# Altium schematic sheet bq25611d_Battery_Charger.SchDoc: bq25611d Battery Charger
size A4; DocumentNumber: 3; SheetNumber: 3; SheetTotal: 50
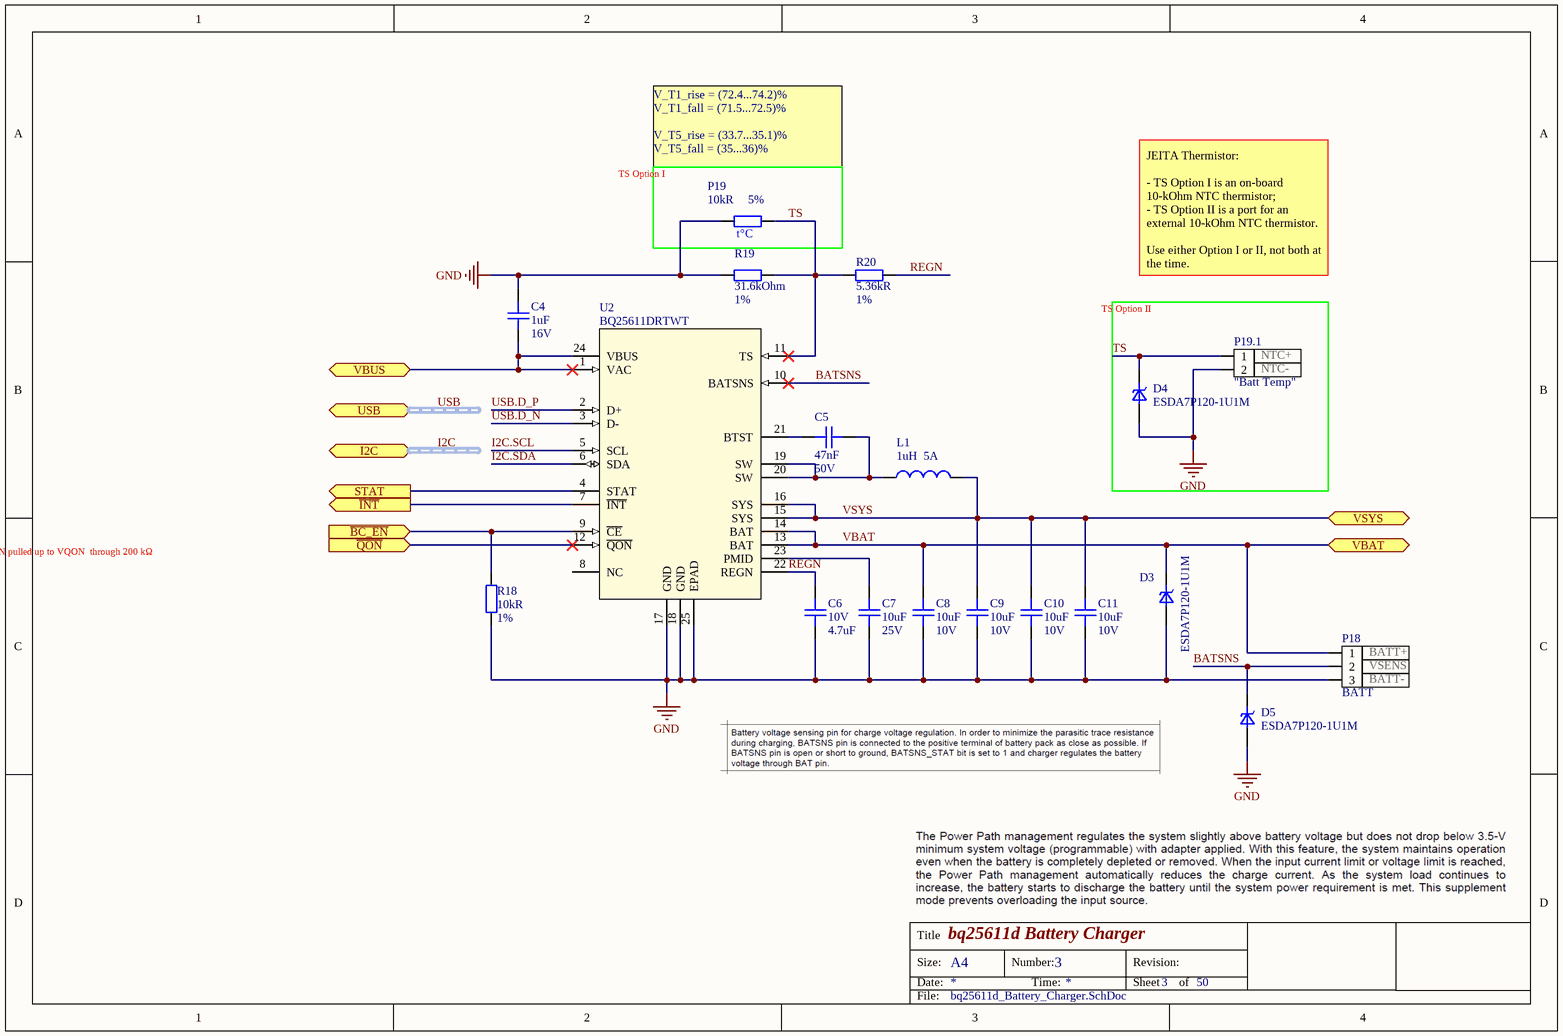
[diagram p0: bq25611d_Battery_Charger.SchDoc]

## Parts
C4  Capacitance: 1uF  Voltage Rating: 16V  [C0603]  (hidden comment: CAP CER 1UF 16V X5R 0603)
C5  Capacitance: 47nF  Voltage Rating: 50V  [C0402]  (hidden comment: CAP CER 0.047UF 50V X7R 0402)
C6  Voltage Rating: 10V  Capacitance: 4.7uF  [C0603]  (hidden comment: CAP CER 4.7UF 10V X5R 0603)
C7  Capacitance: 10uF  Voltage Rating: 25V  [C1206]  (hidden comment: CAP CER 10UF 25V X7R 1206)
C8  Capacitance: 10uF  Voltage Rating: 10V  [C0805]  (hidden comment: CAP CER 10uF X7R 10% 0805)
C9  Capacitance: 10uF  Voltage Rating: 10V  [C0805]  (hidden comment: CAP CER 10uF X7R 10% 0805)
C10  Capacitance: 10uF  Voltage Rating: 10V  [C0805]  (hidden comment: CAP CER 10uF X7R 10% 0805)
C11  Capacitance: 10uF  Voltage Rating: 10V  [C0805]  (hidden comment: CAP CER 10uF X7R 10% 0805)
D3  ESDA7P120-1U1M  [ST_QFN_1610]
D4  ESDA7P120-1U1M  [ST_QFN_1610]
D5  ESDA7P120-1U1M  [ST_QFN_1610]
L1  Inductance: 1uH  Current Rating: 5A  [IND_IHLP-1212B00]  (hidden comment: FIXED IND 1UH 5A 24 MOHM SMD)
P18  BATT  pin_1: BATT+  pin_2: VSENS  pin_3: BATT-  [CONN_S3B-ZR_JST]
P19  Resistance: 10kR  Tolerance: 5%  [R0603]  (hidden comment: THERMISTOR NTC 10KOHM 3380K 0603)
P19.1  "Batt Temp"  pin_1: NTC+  pin_2: NTC-  [CONN_S2B-ZR_JST]
R18  Resistance: 10kR  Tolerance: 1%  [R0402]  (hidden comment: RES SMD 10K OHM 1% 1/16W 0402)
R19  Resistance: 31.6kOhm  Tolerance: 1%  [R0402]  (hidden comment: RES SMD 31.6K OHM 1% 1/16W 0402)
R20  Resistance: 5.36kR  Tolerance: 1%  [R0402]  (hidden comment: RES SMD 5.36K OHM 1% 1/16W 0402)
U2  BQ25611DRTWT  [RTW0024]

## Blocks framed on the sheet
TS Option I: P19
TS Option II: D4 P19.1

## Ports
I2C (harness I2C), STAT (out), USB (harness USB), VBAT, VBUS, VSYS, ~{BC_EN} (in), ~{INT} (out), ~{QON} (in)

## Nets
GND: C4.1 C6.1 C7.1 C8.1 C9.1 C10.1 C11.1 D3.2(A) D4.2(A) D5.2(A) P18.3 P19.2 P19.1.2 R18.2 R19.1 U2.17(GND) U2.18(GND) U2.25(EPAD)
~{BC_EN}: R18.1 U2.9(~{CE}) ; port ~{BC_EN}
~{INT}: U2.7(~{INT}) ; port ~{INT}
~{QON}: U2.12(~{QON}) ; port ~{QON}
BATSNS: D5.1(K) P18.2 U2.10(BATSNS)
I2C.SCL: U2.5(SCL)
I2C.SDA: U2.6(SDA)
REGN: C6.2 R20.1 U2.22(REGN)
STAT: U2.4(STAT) ; port STAT
TS: D4.1(K) P19.1 P19.1.1 R19.2 R20.2 U2.11(TS)
USB.D_N: U2.3(D-)
USB.D_P: U2.2(D+)
VBAT: C8.2 D3.1(K) P18.1 U2.13(BAT) U2.14(BAT) ; port VBAT
VBUS: C4.2 U2.1(VAC) U2.24(VBUS) ; port VBUS
VSYS: C9.2 C10.2 C11.2 L1.2 U2.15(SYS) U2.16(SYS) ; port VSYS
NetC5_1: C5.1 U2.21(BTST)
NetC5_2: C5.2 L1.1 U2.19(SW) U2.20(SW)
NetC7_2: C7.2 U2.23(PMID)

Not connected (* = marked no-connect by the designer): U2 8(NC)

## Buses and harness runs
harness I2C = port I2C
harness USB = port USB

## Notes on the sheet
- V_T1_rise = (72.4...74.2)%
  V_T1_fall = (71.5...72.5)%
  V_T5_rise = (33.7...35.1)%
  V_T5_fall = (35...36)%
- JEITA Thermistor:
  - TS Option I is an on-board 10-kOhm NTC thermistor;
  - TS Option II is a port for an external 10-kOhm NTC thermistor.
  Use either Option I or II, not both at the time.
- QON pulled up to VQON  through 200 kΩ
- Title
- Size:
- Date:
- A4
- Number:
- Time:
- Revision:
- Sheet
- of
- File:
- (in symbol THERMISTOR NTC 10KOHM 3380K 0603) t°C

## Library data of the parts
C4 = CAP CER 1UF 16V X5R 0603: 1µF ±10% 16V Ceramic Capacitor X5R 0603 (1608 Metric); Manuf_Part_1: CC0603KRX5R7BB105; Manuf_1: YAGEO; Dissipation Factor: 7%; Revision: July-2002: Re-released for DXP Platform.; Order: CC0603KRX5R7BB105; Supplier 1: Digi-Key; Manufacturer: Yageo; Manufacturer Part Number: CC0603KRX5R7BB105; Stock 1: 2299176; Pricing 1: 1=0.11, 10=0.081, 100=0.0382, 500=0.0268, 1000=0.0222 (USD); Mount: Surface Mount; Number of Pins: 2; Case Code (Imperial): 0603; Case Code (Metric): 1608; Min Operating Temperature: -55°C; Max Operating Temperature: 85°C; Tolerance: 10%; Dielectric: X5R; Voltage Rating (DC): 16V; Packaging: Tape and Reel; Package Quantity: 4000; Termination: SMD/SMT; Composition: Ceramic; Length: 1.6mm; Height: 0.8mm; Width: 0.8mm; Thickness: 0.035inch; Depth: 0.8mm; Radiation Hardening: No; REACH SVHC: Unknown; Lead Free: Lead Free; Halogen Free: Halogen Free; ComponentLink1URL: https://www.verical.com/server-webapp/html/getDatasheet?partID=317657&src-supplier=Verical; ComponentLink1Description: https://www.verical.com/server-webapp/html/getDatasheet?partID=317657&src-supplier=Verical; ComponentLink2URL: http://www.yageo.com/documents/recent/UPY-GPHC_X5R_4V-to-50V_25.pdf?src-supplier=Digi-Key; ComponentLink2Description: http://www.yageo.com/documents/recent/UPY-GPHC_X5R_4V-to-50V_25.pdf?src-supplier=Digi-Key; ComponentLink3URL: http://www.farnell.com/datasheets/1525783.pdf?src-supplier=Element14; ComponentLink3Description: http://www.farnell.com/datasheets/1525783.pdf?src-supplier=Element14; ComponentLink4URL: http://www.farnell.com/datasheets/1359354.pdf?src-supplier=Element14; ComponentLink4Description: http://www.farnell.com/datasheets/1359354.pdf?src-supplier=Element14; ComponentLink5URL: http://www.yageo.com/documents/recent/UPY-GPHC_X5R_4V-to-50V_12.pdf?src-supplier=Avnet; ComponentLink5Description: http://www.yageo.com/documents/recent/UPY-GPHC_X5R_4V-to-50V_12.pdf?src-supplier=Avnet; Supplier Part Number 1: 311-1444-1-ND; Value: 1uF; Case/Package: 0603
C5 = CAP CER 0.047UF 50V X7R 0402: 0.047µF ±10% 50V Ceramic Capacitor X7R 0402 (1005 Metric); Manufacturer: TDK; Manufacturer Part Number: CGA2B3X7R1H473K050BB; Supplier 1: Digi-Key; Stock 1: 1255429; Pricing 1: 1=0.11, 10=0.083, 50=0.045, 100=0.0368, 500=0.0263, 1000=0.0207, 2500=0.0188, 5000=0.0173 (USD); Mount: Surface Mount; Case/Package: 0402; Weight: 2.3E-05oz; Case Code (Metric): 1005; Case Code (Imperial): 0402; Min Operating Temperature: -55°C; Max Operating Temperature: 125°C; Tolerance: 10%; Dielectric: X7R; Voltage Rating (DC): 50V; Packaging: Tape and Reel; Termination: SMD/SMT; Package Quantity: 1; Composition: Ceramic; Length: 1mm; Height: 0.5mm; Width: 0.02inch; Thickness: 0.022inch; Depth: 0.5mm; Ratings: AEC-Q200; Radiation Hardening: No; Lead Free: Lead Free; REACH SVHC: No SVHC; ComponentLink1URL: http://www.farnell.com/datasheets/1807242.pdf?src-supplier=Element14; ComponentLink1Description: http://www.farnell.com/datasheets/1807242.pdf?src-supplier=Element14; ComponentLink2URL: http://www.farnell.com/datasheets/1735392.pdf?src-supplier=Element14; ComponentLink2Description: http://www.farnell.com/datasheets/1735392.pdf?src-supplier=Element14; ComponentLink3URL: http://www.mouser.com/ds/2/400/lcc_automotive_general_en-843974.pdf?src-supplier=Mouser; ComponentLink3Description: http://www.mouser.com/ds/2/400/lcc_automotive_general_en-843974.pdf?src-supplier=Mouser; Supplier Part Number 1: 445-6897-1-ND
C6 = CAP CER 4.7UF 10V X5R 0603: 4.7µF ±10% 10V Ceramic Capacitor X5R 0603 (1608 Metric); Manufacturer: Yageo; Manufacturer Part Number: CC0603KRX5R6BB475; Supplier 1: Digi-Key; Stock 1: 325858; Pricing 1: 1=0.26, 10=0.18, 100=0.102, 500=0.072, 1000=0.063 (USD); Mount: Surface Mount; Case Code (Imperial): 0603; Case Code (Metric): 1608; Min Operating Temperature: -55°C; Max Operating Temperature: 85°C; Voltage Rating (DC): 10V; Tolerance: 10%; Packaging: Tape and Reel; Package Quantity: 1; Dielectric: X5R; Termination: SMD/SMT; Composition: Ceramic; Length: 1.6mm; Height: 0.8mm; Width: 0.8mm; Thickness: 0.035inch; Depth: 0.8mm; Radiation Hardening: No; REACH SVHC: Unknown; Lead Free: Lead Free; Halogen Free: Halogen Free; ComponentLink1URL: http://www.farnell.com/datasheets/2167237.pdf?src-supplier=Element14; ComponentLink1Description: http://www.farnell.com/datasheets/2167237.pdf?src-supplier=Element14; ComponentLink2URL: http://www.yageo.com/documents/recent/UPY-GPHC_X5R_4V-to-50V_25.pdf?src-supplier=Digi-Key; ComponentLink2Description: http://www.yageo.com/documents/recent/UPY-GPHC_X5R_4V-to-50V_25.pdf?src-supplier=Digi-Key; ComponentLink3URL: http://www.yageo.com/documents/recent/UPY-GPHC_X5R_4V-to-50V_12.pdf?src-supplier=Avnet; ComponentLink3Description: http://www.yageo.com/documents/recent/UPY-GPHC_X5R_4V-to-50V_12.pdf?src-supplier=Avnet; ComponentLink4URL: http://www.yageo.com/documents/recent/UPY-GPHC_X5R_4V-to-50V_12.pdf?src-supplier=Avnet+Europe; ComponentLink4Description: http://www.yageo.com/documents/recent/UPY-GPHC_X5R_4V-to-50V_12.pdf?src-supplier=Avnet+Europe; Supplier Part Number 1: 311-1455-1-ND; Case/Package: 0603
C7 = CAP CER 10UF 25V X7R 1206: 10µF ±10% 25V Ceramic Capacitor X7R 1206 (3216 Metric); Manufacturer: Yageo; Manufacturer Part Number: CC1206KKX7R8BB106; Supplier 1: Digi-Key; Stock 1: 3990; Pricing 1: 1=0.49, 10=0.348, 50=0.2632, 100=0.2293, 500=0.1698, 1000=0.1444 (USD); Mount: Surface Mount; Case/Package: 1206; Weight: 0.000571oz; Case Code (Imperial): 1206; Case Code (Metric): 3216; Min Operating Temperature: -55°C; Max Operating Temperature: 125°C; Tolerance: 10%; Packaging: Tape and Reel; Voltage Rating (DC): 25V; Dielectric: X7R; Termination: SMD/SMT; Composition: Ceramic; Length: 3.2mm; Width: 1.6mm; Thickness: 0.071inch; Depth: 1.6mm; Radiation Hardening: No; Lead Free: Lead Free; Halogen Free: Halogen Free; ComponentLink1URL: http://www.yageo.com/documents/recent/UPY-GPHC_X7R_6.3V-to-50V_8.pdf?src-supplier=Avnet; ComponentLink1Description: http://www.yageo.com/documents/recent/UPY-GPHC_X7R_6.3V-to-50V_8.pdf?src-supplier=Avnet; ComponentLink2URL: http://www.mouser.com/ds/2/447/Yageo_UPY-GP_NP0_16V-to-50V_9-358835.pdf?src-supplier=Mouser; ComponentLink2Description: http://www.mouser.com/ds/2/447/Yageo_UPY-GP_NP0_16V-to-50V_9-358835.pdf?src-supplier=Mouser; ComponentLink3URL: http://components.arrow.com/part/dataview/0323_04166677?src-supplier=Arrow+Europe; ComponentLink3Description: http://components.arrow.com/part/dataview/0323_04166677?src-supplier=Arrow+Europe; ComponentLink4URL: http://www.yageo.com/documents/recent/UPY-GPHC_X7R_6.3V-to-50V_18.pdf?src-supplier=Digi-Key; ComponentLink4Description: http://www.yageo.com/documents/recent/UPY-GPHC_X7R_6.3V-to-50V_18.pdf?src-supplier=Digi-Key; ComponentLink5URL: http://www.yageo.com/documents/recent/UPY-GPHC_X7R_6.3V-to-50V_9.pdf?src-supplier=Future+Electronics; ComponentLink5Description: http://www.yageo.com/documents/recent/UPY-GPHC_X7R_6.3V-to-50V_9.pdf?src-supplier=Future+Electronics; Supplier Part Number 1: 311-1959-1-ND
C8-C11 = CAP CER 10uF X7R 10% 0805: Capacitor,10uF,10V,X7R,10%,0805,Murata; Manufacturer Part Number: GRM21BR71A106KA73L; Supplier 1: Digi-Key; Manufacturer: Murata; Stock 1: 2099435; Pricing 1: 1=0.26, 10=0.176, 100=0.089, 500=0.0609, 1000=0.0538 (USD); Mount: Surface Mount; Case/Package: 0805; Case Code (Imperial): 0805; Case Code (Metric): 2012; Min Operating Temperature: -55°C; Max Operating Temperature: 125°C; Tolerance: 10%; Dielectric: X7R; Voltage Rating (DC): 10V; Packaging: Tape and Reel; Package Quantity: 3000; Termination: SMD/SMT; Length: 2mm; Height: 1.25mm; Width: 1.25mm; Thickness: 0.055inch; Depth: 1.25mm; REACH SVHC: No SVHC; ComponentLink1URL: http://components.arrow.com/part/dataview/0323_07281730?src-supplier=Arrow+Europe; ComponentLink1Description: http://components.arrow.com/part/dataview/0323_07281730?src-supplier=Arrow+Europe; ComponentLink2URL: http://www.mouser.com/ds/2/281/c02e-2905.pdf?src-supplier=Mouser; ComponentLink2Description: http://www.mouser.com/ds/2/281/c02e-2905.pdf?src-supplier=Mouser; ComponentLink3URL: http://www.farnell.com/datasheets/2079188.pdf?src-supplier=Newark; ComponentLink3Description: http://www.farnell.com/datasheets/2079188.pdf?src-supplier=Newark; ComponentLink4URL: http://www.farnell.com/datasheets/2079188.pdf?src-supplier=Farnell; ComponentLink4Description: http://www.farnell.com/datasheets/2079188.pdf?src-supplier=Farnell; ComponentLink5URL: http://www.farnell.com/datasheets/2079188.pdf?src-supplier=Element14; ComponentLink5Description: http://www.farnell.com/datasheets/2079188.pdf?src-supplier=Element14; Supplier Part Number 1: 490-10516-1-ND; Weight: 0.000335oz; ComponentLink6URL: http://search.murata.co.jp/Ceramy/image/img/A01X/G101/ENG/GRM21BR71A106KA73-01.pdf?src-supplier=Digi-Key; ComponentLink6Description: http://search.murata.co.jp/Ceramy/image/img/A01X/G101/ENG/GRM21BR71A106KA73-01.pdf?src-supplier=Digi-Key
D3-D5 = TVS DIODE ESDA7P120-1U1M 5.5V 11.5V 1610: 11.5V Clamp 120A (8/20µs) Ipp Tvs Diode Surface Mount 1610; Manufacturer: STMicroelectronics; Reverse Standoff Voltage: 5.5V; Number of Unidirectional Channels: 1; Min Breakdown Voltage: 6.4V; Peak Pulse Power: 1.4kW; Power Line Protection: No; Supplier 1: Digi-Key; Manufacturer Part Number: ESDA7P120-1U1M; Stock 1: 15775; Pricing 1: 1=0.35, 10=0.287, 25=0.2624, 100=0.1647, 250=0.1629, 500=0.1525, 1000=0.1037, 2500=0.0994 (USD); Packaging: Cut Tape; ComponentLink1URL: http://www.st.com/content/ccc/resource/technical/document/datasheet/group3/5e/7c/5d/76/3f/de/45/35/DM00359316/files/DM00359316.pdf/jcr:content/translations/en.DM00359316.pdf?src-supplier=Digi-Key; ComponentLink1Description: http://www.st.com/content/ccc/resource/technical/document/datasheet/group3/5e/7c/5d/76/3f/de/45/35/DM00359316/files/DM00359316.pdf/jcr:content/translations/en.DM00359316.pdf?src-supplier=Digi-Key; Supplier Part Number 1: 497-17159-1-ND; Mount: Surface Mount; Case/Package: 0603; Case Code (Imperial): 0603; Case Code (Metric): 1610; Min Operating Temperature: -55°C; Max Operating Temperature: 150°C; Composition: Zener; Clamping Voltage: 11.5V; Peak Pulse Current: 120A; ComponentLink2URL: http://www.farnell.com/datasheets/2815837.pdf?src-supplier=Newark; ComponentLink2Description: http://www.farnell.com/datasheets/2815837.pdf?src-supplier=Newark; ComponentLink3URL: http://www.farnell.com/datasheets/2815837.pdf?src-supplier=Farnell; ComponentLink3Description: http://www.farnell.com/datasheets/2815837.pdf?src-supplier=Farnell; ComponentLink4URL: http://www.farnell.com/datasheets/2815837.pdf?src-supplier=Element14; ComponentLink4Description: http://www.farnell.com/datasheets/2815837.pdf?src-supplier=Element14
L1 = FIXED IND 1UH 5A 24 MOHM SMD: 1µH Shielded Molded Inductor 5A 24mOhm Max Nonstandard; Manufacturer: Vishay Dale; Manufacturer Part Number: IHLP1212BZER1R0M11; Core Material: Metal,Composite; Tolerance: 20%; DC Resistance (DCR): 24mR; Self Resonant Frequency: 75MHz; Saturation Current: 4.5A; Test Frequency: 100kHz; Supplier 1: Digi-Key; Stock 1: 70286; Pricing 1: 1=1.39, 10=1.287, 25=1.188, 50=0.99, 100=0.9306, 250=0.8316, 500=0.7128, 1000=0.6336 (USD); Mount: Surface Mount; Case/Package: 1212; Number of Pins: 2; Case Code (Metric): 3630; Case Code (Imperial): 1212; Contact Plating: Tin; Min Operating Temperature: -55°C; Max Operating Temperature: 125°C; Shielding: Shielded; Packaging: Tape and Reel; Package Quantity: 3000; Inductance Tolerance: 20%; Max DC Current: 5A; Termination: SMD/SMT; RMS Current (Irms): 5A; Military Standard: Not; Length: 3.6mm; Height: 2mm; Depth: 3.2mm; Width: 0.118inch; Height - Seated (Max): 0.079inch; Radiation Hardening: No; REACH SVHC: Unknown; Lead Free: Lead Free; ComponentLink1URL: http://www.mouser.com/ds/2/427/lp12bz11-244380.pdf?src-supplier=Mouser; ComponentLink1Description: http://www.mouser.com/ds/2/427/lp12bz11-244380.pdf?src-supplier=Mouser; ComponentLink2URL: http://www.vishay.com/docs/34289/lp12bz11.pdf?src-supplier=Digi-Key; ComponentLink2Description: http://www.vishay.com/docs/34289/lp12bz11.pdf?src-supplier=Digi-Key; ComponentLink3URL: http://www.vishay.com/docs/34289/lp12bz11.pdf?src-supplier=Avnet; ComponentLink3Description: http://www.vishay.com/docs/34289/lp12bz11.pdf?src-supplier=Avnet; ComponentLink4URL: http://www.farnell.com/datasheets/652599.pdf?src-supplier=Element14; ComponentLink4Description: http://www.farnell.com/datasheets/652599.pdf?src-supplier=Element14; ComponentLink5URL: http://www.vishay.com/docs/34289/lp12bz11.pdf?src-supplier=Avnet+Europe; ComponentLink5Description: http://www.vishay.com/docs/34289/lp12bz11.pdf?src-supplier=Avnet+Europe; ComponentLink6URL: https://www.verical.com/server-webapp/html/getDatasheet?partID=180380&src-supplier=Verical; ComponentLink6Description: https://www.verical.com/server-webapp/html/getDatasheet?partID=180380&src-supplier=Verical; Supplier Part Number 1: 541-1319-1-ND
P18 = CONN HEADER TH R/A 3POS 1.5MM: Connector Header Through Hole, Right Angle 3 position 0.059" (1.50mm); Manufacturer: JST; Manufacturer Part Number: S3B-ZR(LF)(SN); Number of Positions: 3; Connector Type: Male Pin; Voltage Rating: 50V; Contact Resistance: 30mR; Max Current Rating: 1A; Gender: Male; Pitch: 1.5mm; Body Plating: Tin; Insulation Resistance: 500MR; Panel Thickness: 3.5mm; Supplier 1: Digi-Key; Stock 1: 0; Mount: Through Hole; Number of Pins: 3; Color: Natural,White; Contact Plating: Tin,Copper; Contact Material: Brass,Copper,Tin; Housing Color: Beige; Housing Material: Polyamide; Min Operating Temperature: -25°C; Max Operating Temperature: 85°C; Packaging: Bulk; Number of Rows: 1; Termination: Press-Fit; Current Rating: 1A; Fastening Type: Detent; Max Voltage Rating (AC): 50V; Number of Contacts: 3; Orientation: Right Angle; Length: 6mm; Height: 7.2mm; Width: 3.5mm; Depth: 6mm; Contact Mating Length: 0.094inch; Lead Free: Lead Free; ComponentLink1URL: http://www.jst-mfg.com/product/pdf/eng/eZH.pdf?src-supplier=Digi-Key; ComponentLink1Description: http://www.jst-mfg.com/product/pdf/eng/eZH.pdf?src-supplier=Digi-Key; ComponentLink2URL: https://www.verical.com/server-webapp/html/getDatasheet?partID=722697&src-supplier=Verical; ComponentLink2Description: https://www.verical.com/server-webapp/html/getDatasheet?partID=722697&src-supplier=Verical; ComponentLink3URL: http://www.produktinfo.conrad.com/datenblaetter/725000-749999/741155-da-01-en-STIFTLEISTE_GEWINKELT_3_POL_RM1_5.pdf?src-supplier=Conrad; ComponentLink3Description: http://www.produktinfo.conrad.com/datenblaetter/725000-749999/741155-da-01-en-STIFTLEISTE_GEWINKELT_3_POL_RM1_5.pdf?src-supplier=Conrad; Supplier Part Number 1: 455-1670-ND; Pricing 1: 1=0.2, 10=0.184, 100=0.1274, 500=0.1078, 1000=0.0882, 5000=0.0784, 10000=0.071 (USD); Material: Nylon; Voltage Rating (AC): 50V; Voltage Rating (DC): 50V; Lead Pitch: 1.5mm; REACH SVHC: No SVHC; Flammability Rating: UL94 V-0
P19 = THERMISTOR NTC 10KOHM 3380K 0603: NTC Thermistor 10k 0603 (1608 Metric); Manufacturer: Panasonic; Manufacturer Part Number: ERT-J1VG103JA; Max Power Dissipation: 100mW; Accuracy: 1%; Supplier 1: Digi-Key; Stock 1: 28072; Pricing 1: 1=0.15, 5=0.146, 10=0.13, 25=0.12, 50=0.096, 100=0.0824, 500=0.0721, 1000=0.0618 (USD); Mount: Surface Mount; Case/Package: 0603; Number of Pins: 2; Case Code (Metric): 1608; Case Code (Imperial): 0603; Min Operating Temperature: -40°C; Max Operating Temperature: 125°C; Packaging: Tape and Reel; Package Quantity: 4000; Termination: SMD/SMT; Length: 1.6mm; Depth: 0.8mm; Width: 800um; Radiation Hardening: No; Lead Free: Lead Free; REACH SVHC: No SVHC; ComponentLink1URL: http://www.farnell.com/datasheets/2085569.pdf?src-supplier=Farnell; ComponentLink1Description: http://www.farnell.com/datasheets/2085569.pdf?src-supplier=Farnell; ComponentLink2URL: http://www.farnell.com/datasheets/1314428.pdf?src-supplier=Element14; ComponentLink2Description: http://www.farnell.com/datasheets/1314428.pdf?src-supplier=Element14; ComponentLink3URL: https://industrial.panasonic.com/cdbs/www-data/pdf/AUA0000/AUA0000COL16.pdf?src-supplier=Digi-Key; ComponentLink3Description: https://industrial.panasonic.com/cdbs/www-data/pdf/AUA0000/AUA0000COL16.pdf?src-supplier=Digi-Key; ComponentLink4URL: http://industrial.panasonic.com/www-data/pdf/AUA0000/AUA0000CE1.pdf?src-supplier=Future+Electronics; ComponentLink4Description: http://industrial.panasonic.com/www-data/pdf/AUA0000/AUA0000CE1.pdf?src-supplier=Future+Electronics; ComponentLink5URL: https://industrial.panasonic.com/www-data/pdf/AUA0000/AUA0000CE1.pdf?src-supplier=Avnet; ComponentLink5Description: https://industrial.panasonic.com/www-data/pdf/AUA0000/AUA0000CE1.pdf?src-supplier=Avnet; Supplier Part Number 1: P12014CT-ND
P19.1 = CONN HEADER TH R/A 2POS 1.5MM: Connector Header Through Hole, Right Angle 2 position 0.059" (1.50mm); Manufacturer: JST; Manufacturer Part Number: S2B-ZR(LF)(SN); Body Plating: Tin; Number of Positions: 2; Gender: Male; Connector Type: Male Pin; Current Rating: 1A; Contact Resistance: 30mR; Voltage Rating: 50V; Insulation Resistance: 500MR; Pitch: 1.5mm; Panel Thickness: 3.5mm; Supplier 1: Digi-Key; Stock 1: 14685; Pricing 1: 1=0.19, 10=0.177, 100=0.109, 500=0.0902, 1000=0.079, 5000=0.0677, 10000=0.0658 (USD); Mount: Through Hole; Number of Pins: 2; Contact Plating: Tin,Copper; Contact Material: Brass,Tin,Copper; Color: Natural,White; Housing Color: Beige; Housing Material: Polyamide; Material: Nylon; Min Operating Temperature: -25°C; Max Operating Temperature: 85°C; Termination: Press-Fit; Number of Rows: 1; Packaging: Bulk; Fastening Type: Detent; Number of Contacts: 2; Orientation: Right Angle; Voltage Rating (AC): 50V; Voltage Rating (DC): 50V; Max Current Rating: 1A; Max Voltage Rating (AC): 50V; Length: 4.5mm; Height: 7.2mm; Width: 3.5mm; Contact Mating Length: 0.094inch; Depth: 6mm; Lead Pitch: 1.5mm; Lead Free: Lead Free; Flammability Rating: UL94 V-0; REACH SVHC: No SVHC; ComponentLink1URL: http://www.farnell.com/datasheets/80556.pdf?src-supplier=Element14; ComponentLink1Description: http://www.farnell.com/datasheets/80556.pdf?src-supplier=Element14; ComponentLink2URL: http://www1.futureelectronics.com/doc/JST/S2B-ZR(LF)(SN).pdf?src-supplier=Future+Electronics; ComponentLink2Description: http://www1.futureelectronics.com/doc/JST/S2B-ZR(LF)(SN).pdf?src-supplier=Future+Electronics; ComponentLink3URL: http://www.jst-mfg.com/product/pdf/eng/eZH.pdf?src-supplier=Digi-Key; ComponentLink3Description: http://www.jst-mfg.com/product/pdf/eng/eZH.pdf?src-supplier=Digi-Key; ComponentLink4URL: https://www.verical.com/server-webapp/html/getDatasheet?partID=687340&src-supplier=Verical; ComponentLink4Description: https://www.verical.com/server-webapp/html/getDatasheet?partID=687340&src-supplier=Verical; Supplier Part Number 1: 455-1669-ND
R18 = RES SMD 10K OHM 1% 1/16W 0402: 10 kOhms ±1% 0.063W, 1/16W Chip Resistor 0402 (1005 Metric) Moisture Resistant Thick Film; Manufacturer Part Number: RC0402FR-0710KP; Manufacturer: Yageo; Temperature Coefficient: 150ppm/°C; Max Power Dissipation: 63mW; Supplier 1: Digi-Key; Stock 1: 839368; Pricing 1: 1=0.1, 10=0.035, 100=0.014, 1000=0.0063, 2500=0.0055, 5000=0.0045 (USD); Case Code (Imperial): 0402; Case Code (Metric): 1005; Min Operating Temperature: -55°C; Max Operating Temperature: 155°C; Composition: Thick Film; Packaging: Tape and Reel; Number of Terminations: 2; Length: 0.039inch; Height: 0.016inch; Width: 0.02inch; ComponentLink1URL: http://www.yageo.com/NewPortal/yageodocoutput?fileName=/pdf/R-Chip/PYu-RC_51_RoHS_P_0.pdf&src-supplier=Digi-Key; ComponentLink1Description: http://www.yageo.com/NewPortal/yageodocoutput?fileName=/pdf/R-Chip/PYu-RC_51_RoHS_P_0.pdf&src-supplier=Digi-Key; Supplier Part Number 1: YAG1249CT-ND; Case/Package: 0402; Features: Moisture Resistant; Mount: Surface Mount
R19 = RES SMD 31.6K OHM 1% 1/16W 0402: 31.6 kOhms ±1% 0.063W, 1/16W Chip Resistor 0402 (1005 Metric) Moisture Resistant Thick Film; Manufacturer Part Number: RC0402FR-0731K6L; Manufacturer: Yageo; Temperature Coefficient: 100ppm/°C; Voltage Rating (DC): 50V; Power Rating: 62.5mW; Max Power Dissipation: 63mW; Supplier 1: Digi-Key; Stock 1: 2889310; Pricing 1: 1=0.1, 10=0.016, 100=0.0064, 1000=0.0029, 2500=0.0025, 5000=0.0021 (USD); Case Code (Imperial): 0402; Case Code (Metric): 1005; Min Operating Temperature: -55°C; Max Operating Temperature: 155°C; Composition: Thick Film; Packaging: Tape and Reel; Voltage Rating: 50V; Termination: SMD/SMT; Military Standard: Not; Number of Terminations: 2; Length: 1mm; Height: 0.016inch; Width: 0.02inch; Depth: 0.5mm; Lead Free: Lead Free; ComponentLink1URL: http://www.yageo.com/documents/recent/PYu-RC0402_51_RoHS_L_6_r.pdf?src-supplier=Future+Electronics; ComponentLink1Description: http://www.yageo.com/documents/recent/PYu-RC0402_51_RoHS_L_6_r.pdf?src-supplier=Future+Electronics; ComponentLink2URL: http://www.yageo.com/documents/recent/PYu-RC0402_51_RoHS_L_6_r.pdf?src-supplier=Mouser; ComponentLink2Description: http://www.yageo.com/documents/recent/PYu-RC0402_51_RoHS_L_6_r.pdf?src-supplier=Mouser; Supplier Part Number 1: YAG3115CT-ND; Case/Package: 0402; Weight: 10.729601oz; Package Quantity: 10000; Features: Moisture Resistant; Mount: Surface Mount
R20 = RES SMD 5.36K OHM 1% 1/16W 0402: 5.36 kOhms ±1% 0.063W, 1/16W Chip Resistor 0402 (1005 Metric) Moisture Resistant Thick Film; Manufacturer Part Number: RC0402FR-075K36L; Manufacturer: Yageo; Temperature Coefficient: 100ppm/°C; Voltage Rating (DC): 50V; Power Rating: 62.5mW; Max Power Dissipation: 63mW; Supplier 1: Digi-Key; Stock 1: 170749; Pricing 1: 1=0.1, 10=0.016, 100=0.0064, 1000=0.0029, 2500=0.0025, 5000=0.0021 (USD); Case Code (Imperial): 0402; Case Code (Metric): 1005; Min Operating Temperature: -55°C; Max Operating Temperature: 155°C; Composition: Thick Film; Packaging: Tape and Reel; Voltage Rating: 50V; Termination: SMD/SMT; Military Standard: Not; Number of Terminations: 2; Length: 1mm; Height: 0.016inch; Width: 0.02inch; Depth: 0.5mm; Lead Free: Lead Free; ComponentLink1URL: https://www.verical.com/server-webapp/html/getDatasheet?partID=314179&src-supplier=Verical; ComponentLink1Description: https://www.verical.com/server-webapp/html/getDatasheet?partID=314179&src-supplier=Verical; ComponentLink2URL: http://www.yageo.com/pdf/PYu-RC0402_51_RoHS_L_4.pdf?src-supplier=Avnet; ComponentLink2Description: http://www.yageo.com/pdf/PYu-RC0402_51_RoHS_L_4.pdf?src-supplier=Avnet; ComponentLink3URL: http://www.yageo.com/documents/recent/PYu-RC_Group_51_RoHS_L_10.pdf?src-supplier=Digi-Key; ComponentLink3Description: http://www.yageo.com/documents/recent/PYu-RC_Group_51_RoHS_L_10.pdf?src-supplier=Digi-Key; ComponentLink4URL: http://www.yageo.com/documents/recent/PYu-RC0402_51_RoHS_L_6_r.pdf?src-supplier=Mouser; ComponentLink4Description: http://www.yageo.com/documents/recent/PYu-RC0402_51_RoHS_L_6_r.pdf?src-supplier=Mouser; Supplier Part Number 1: 311-5.36KLRCT-ND; Case/Package: 0402; Package Quantity: 1; Features: Moisture Resistant; ComponentLink5URL: http://www.yageo.com/documents/recent/PYu-RC0402_51_RoHS_L_6.pdf?src-supplier=Avnet+Europe; ComponentLink5Description: http://www.yageo.com/documents/recent/PYu-RC0402_51_RoHS_L_6.pdf?src-supplier=Avnet+Europe; Contact Plating: Tin,Lead,Matte; Radiation Hardening: No; Mount: Surface Mount
U2 = IC BQ25611DRTWR BATTERY CHARGER WQFN-24: Charger IC Lithium Ion/Polymer 24-WQFN (4x4); Manufacturer: Texas Instruments; Product Status: New Product; Supplier 1: Mouser; Manufacturer Part Number: BQ25611DRTWT; RoHS: RoHS Compliant; Category: Battery Management; Stock 1: 208; Pricing 1: 1=4.41, 10=3.96, 100=3.34, 250=2.91, 500=2.76, 1000=2.33, 2500=2.21, 5000=2.13 (USD); Packaging: Cut Tape; Brand: Texas Instruments; Moisture Sensitive: Yes; Product Type: Battery Management; Standard Pack Qty: 250; Subcategory: PMIC - Power Management ICs; RoHS - Mouser: Y; Minimum Order Quantity: 1; Reeling: True; ComponentLink1URL: https://www.ti.com/lit/gpn/bq25611d; ComponentLink1Description: Data sheet; Supplier Part Number 1: 595-BQ25611DRTWT; Mount: Surface Mount